# EAGLE design working (EAGLE 5.12)
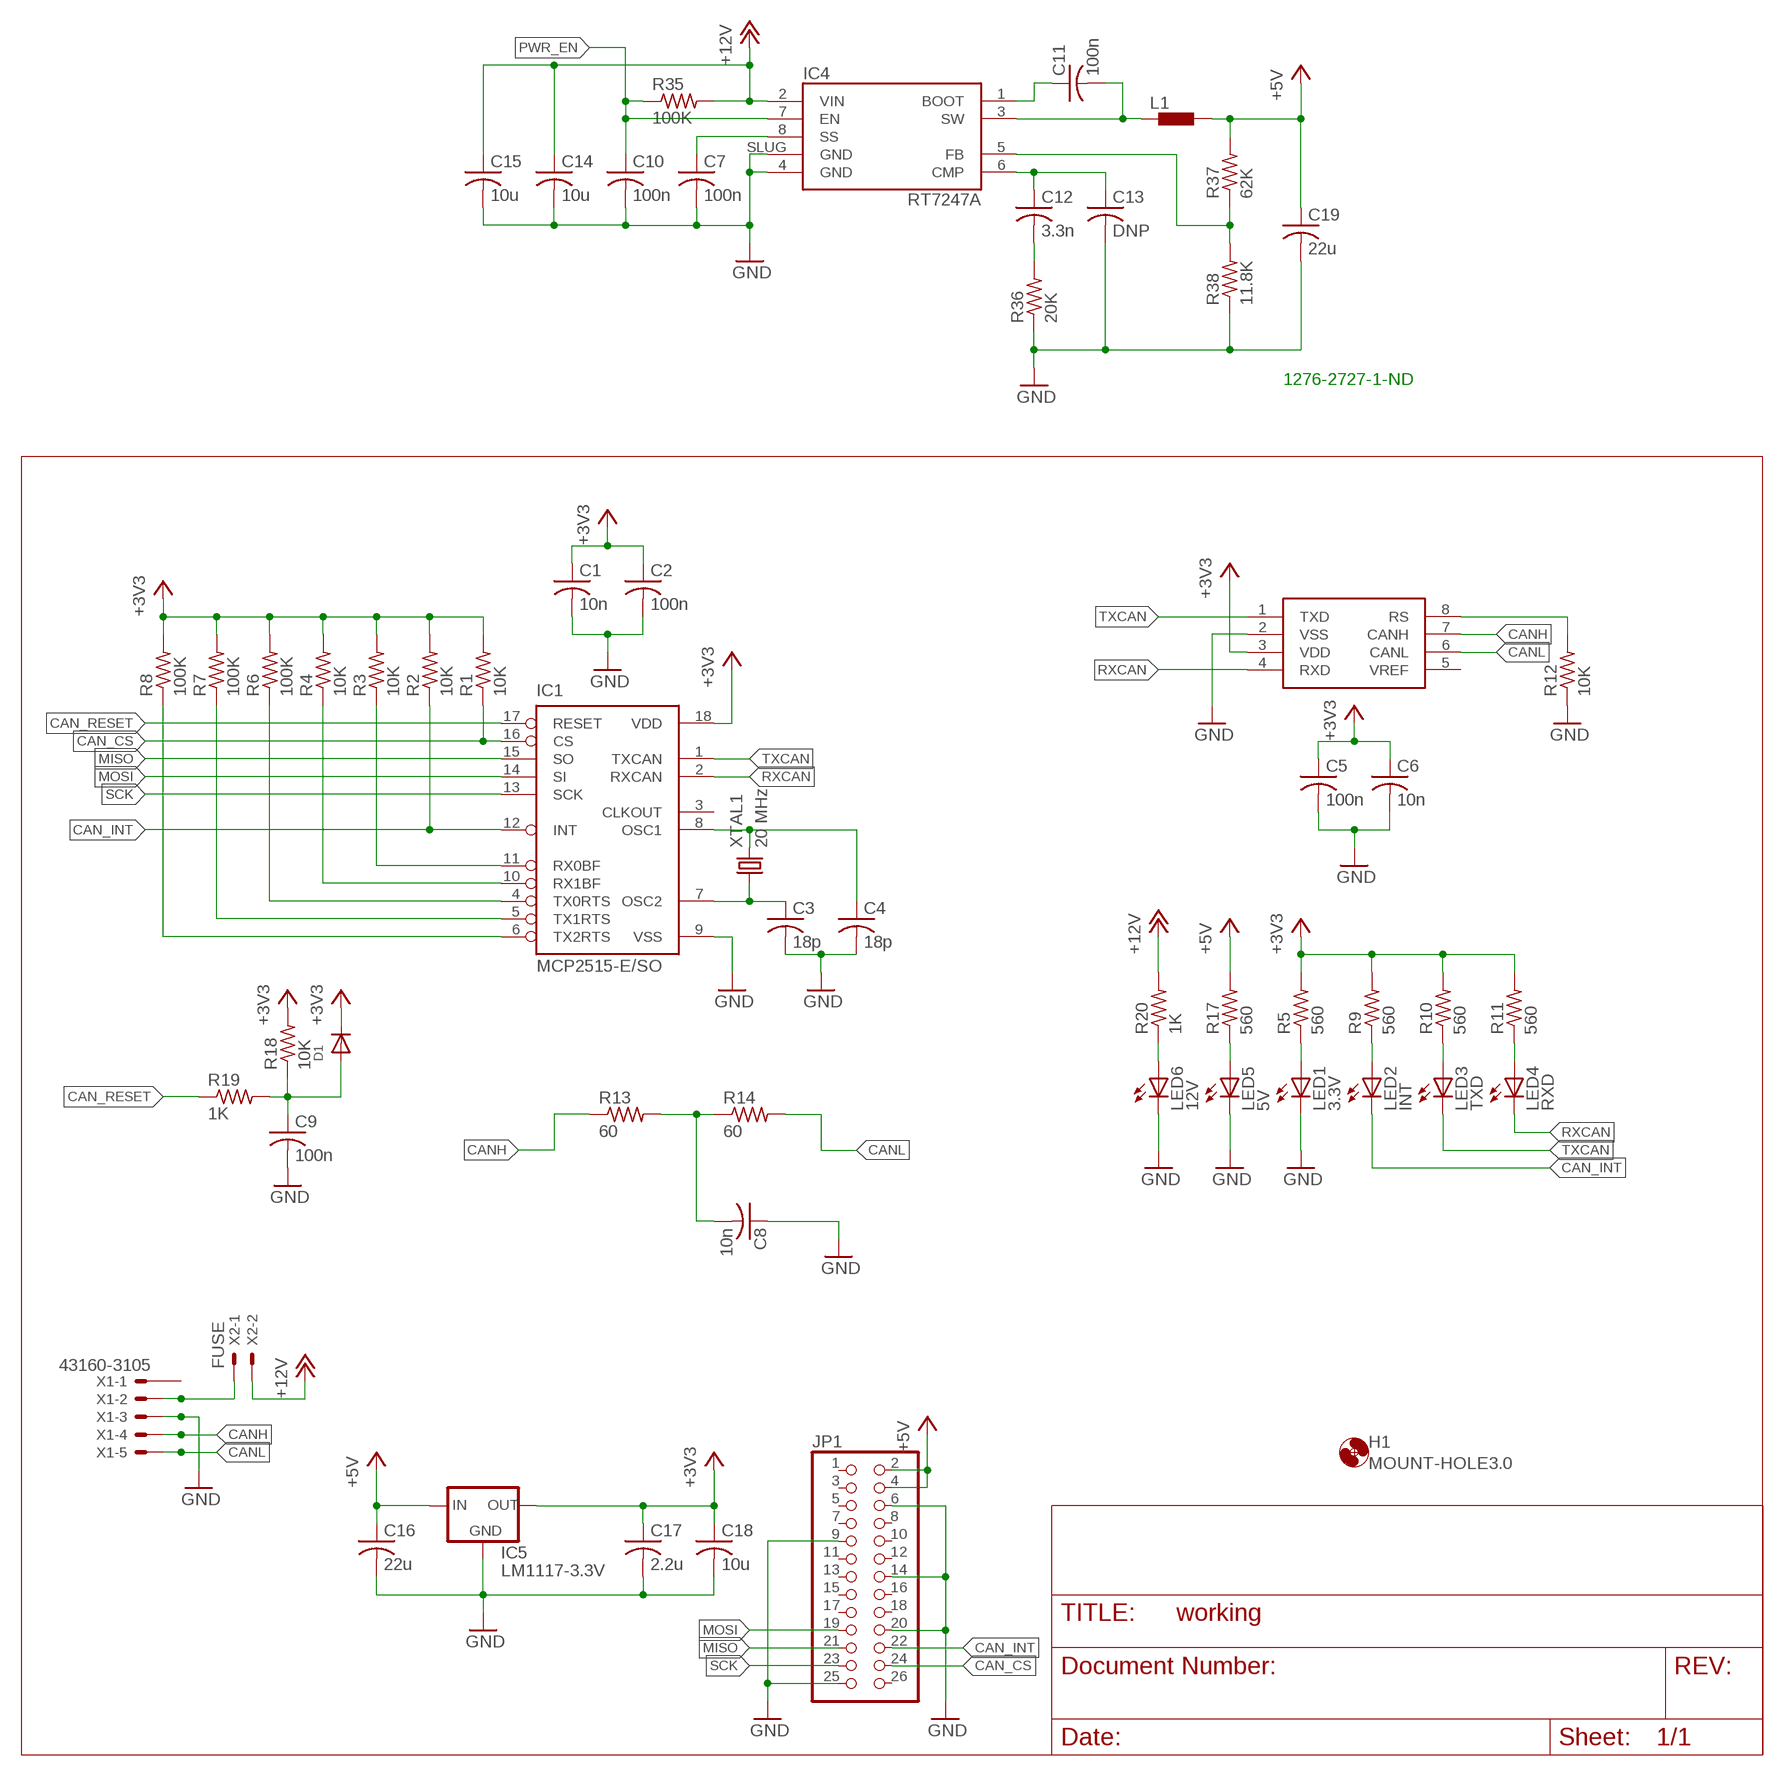
[diagram p0: schematic, sheet 1]

## Parts
C1  10n  C-USC0603  [C0603]
C2  100n  C-USC0603  [C0603]
C3  18p  C-USC0603  [C0603]
C4  18p  C-USC0603  [C0603]
C5  100n  C-USC0603  [C0603]
C6  10n  C-USC0603  [C0603]
C7  100n  C-USC0603  [C0603]
C8  10n  C-USC0603  [C0603]
C9  100n  C-USC0603  [C0603]
C10  100n  C-USC0603  [C0603]
C11  100n  C-USC0603  [C0603]
C12  3.3n  C-USC0603  [C0603]
C13  DNP  C-USC0603  [C0603]
C14  10u  C-USC1206  [C1206]
C15  10u  C-USC1206  [C1206]
C16  22u  C-USC1206  [C1206]
C17  2.2u  C-USC0805  [C0805]
C18  10u  C-USC1206  [C1206]
C19  22u  C-USC1206  [C1206]
D1  DIODESMA  [SMADIODE]
H1  MOUNT-HOLE3.0  [3,0]
IC1  MCP2515-E/SO  [SO18L]
IC2  SN65HVD232D  MCP2551  [SO08]
IC4  RT7247A  [SO08]
IC5  LM1117-3.3V  LM1117  [SOT223]
JP1  PINHD-2X13  [2X13]
L1  DR1030  [DR1030]
LED1  3.3V  LEDCHIP-LED0805  [CHIP-LED0805]
LED2  INT  LEDCHIP-LED0805  [CHIP-LED0805]
LED3  TXD  LEDCHIP-LED0805  [CHIP-LED0805]
LED4  RXD  LEDCHIP-LED0805  [CHIP-LED0805]
LED5  5V  LEDCHIP-LED0805  [CHIP-LED0805]
LED6  12V  LEDCHIP-LED0805  [CHIP-LED0805]
R1  10K  R-US_R0603  [R0603]
R2  10K  R-US_R0603  [R0603]
R3  10K  R-US_R0603  [R0603]
R4  10K  R-US_R0603  [R0603]
R5  560  R-US_R0603  [R0603]
R6  100K  R-US_R0603  [R0603]
R7  100K  R-US_R0603  [R0603]
R8  100K  R-US_R0603  [R0603]
R9  560  R-US_R0603  [R0603]
R10  560  R-US_R0603  [R0603]
R11  560  R-US_R0603  [R0603]
R12  10K  R-US_R0603  [R0603]
R13  60  R-US_R0603  [R0603]
R14  60  R-US_R0603  [R0603]
R17  560  R-US_R0603  [R0603]
R18  10K  R-US_R0603  [R0603]
R19  1K  R-US_R0603  [R0603]
R20  1K  R-US_R0603  [R0603]
R35  100K  R-US_R0603  [R0603]
R36  20K  R-US_R0603  [R0603]
R37  62K  R-US_R0603  [R0603]
R38  11.8K  R-US_R0603  [R0603]
X1  43160-3105  [43160-XX05]
X2  FUSE  22-23-2021  [22-23-2021]
XTAL1  20 MHz  CRYSTALSM49  [SM49]

## Nets
+3V3: C1.1 C2.1 C5.1 C6.1 C17.1 C18.1 D1.C IC1.18(VDD) IC2.3(VDD) IC5.2(OUT) R1.2 R2.2 R3.2 R4.2 R5.2 R6.2 R7.2 R8.2 R9.2 R10.2 R11.2 R18.2
+5V: C16.1 C19.1 IC5.3(IN) JP1.2 JP1.4 L1.2 R17.2 R37.2
+12V: C14.1 C15.1 IC4.2(VIN) R20.2 R35.2 X2.2
CAN_CS: IC1.16(CS) JP1.24 R1.1
CAN_INT: IC1.12(INT) JP1.22 LED2.C R2.1
CAN_RESET: IC1.17(RESET) R19.1
CANH: IC2.7(CANH) R13.1 X1.4@1(-4:S) X1.4@2(-4:S)
CANL: IC2.6(CANL) R14.2 X1.5@1(-5:S) X1.5@2(-5:S)
GND: C1.2 C2.2 C3.2 C4.2 C5.2 C6.2 C7.2 C8.1 C9.2 C10.2 C13.2 C14.2 C15.2 C16.2 C17.2 C18.2 C19.2 IC1.9(VSS) IC2.2(VSS) IC4.4(GND) IC4.SLUG(GND) IC5.1(GND) JP1.6 JP1.9 JP1.14 JP1.20 JP1.25 LED1.C LED5.C LED6.C R12.1 R36.1 R38.1 X1.3@1(-3:S) X1.3@2(-3:S)
MISO: IC1.15(SO) JP1.21
MOSI: IC1.14(SI) JP1.19
N$1: IC1.11(RX0BF) R3.1
N$2: IC1.10(RX1BF) R4.1
N$3: IC1.4(TX0RTS) R6.1
N$4: IC1.5(TX1RTS) R7.1
N$5: IC1.6(TX2RTS) R8.1
N$6: C4.1 IC1.8(OSC1) XTAL1.2
N$7: C3.1 IC1.7(OSC2) XTAL1.1
N$8: IC2.8(RS) R12.2
N$9: LED1.A R5.1
N$10: LED2.A R9.1
N$11: LED3.A R10.1
N$12: LED4.A R11.1
N$18: C8.2 R13.2 R14.1
N$19: LED5.A R17.1
N$20: C9.1 D1.A R18.1 R19.2
N$21: LED6.A R20.1
N$69: X1.2@1(-2:S) X1.2@2(-2:S) X2.1
N$92: C7.1 IC4.8(SS)
N$95: C11.1 IC4.1(BOOT)
N$96: C11.2 IC4.3(SW) L1.1
N$97: C12.1 C13.1 IC4.6(CMP)
N$98: C12.2 R36.2
N$99: IC4.5(FB) R37.1 R38.2
PWR_EN: C10.1 IC4.7(EN) R35.1
RXCAN: IC1.2(RXCAN) IC2.4(RXD) LED4.C
SCK: IC1.13(SCK) JP1.23
TXCAN: IC1.1(TXCAN) IC2.1(TXD) LED3.C
Unconnected: IC1.3(CLKOUT) IC2.5(VREF) JP1.1 JP1.3 JP1.5 JP1.7 JP1.8 JP1.10 JP1.11 JP1.12 JP1.13 JP1.15 JP1.16 JP1.17 JP1.18 JP1.26 X1.1@1(-1:S) X1.1@2(-1:S)

## Notes on the sheet
- 1276-2727-1-ND

## Library data of the parts
C1-C19 = rcl:C-US: CAPACITOR, American symbol
D1 = adafruit:DIODE: Diode SMADIODE - SMA Surface Mount Package 20V 1A Schottky Diode Digikey: 641-1014-6-ND DO-1N4148 - Through Hole Small Current Diode SOD-123 20V 1 A (.5mV Vf) Schottky Diode - Digikey: MBRX120TPMSCT-ND SOD-323 10V 570mA (.38mV Vf, 3ns) Schottky Diode - Digikey: ZLLS410CT-ND SOD-523 30V 30mA Schottky Diode (RB751S-40TE61) - Digikey: RB751S-40TE61CT-ND SOT23-R/W - SOT23 Package (R = Solder Paste/Reflow Ovens, W = Hand-Soldering) BAT54Film 40V 300mA - Digikey: 497-7162-1-ND
H1 = holes:MOUNT-HOLE: MOUNTING HOLE with drill center marker
IC1 = mcp2515:MCP2515
IC2 = SparkFun:MCP2551
IC4 = rbg-richtek-vreg:RT7247A
IC5 = v-reg-3:LM1117
JP1 = pinhead:PINHD-2X13: PIN HEADER
L1 = inductors:DR1030: DR1030 Series Low Profile Power Inductors Source: Data sheet <http://www.cooperbussmann.com/pdf/c73e479f-f867-4c64-ae26-9c1f23814163.pdf>
LED1-LED6 = led:LED: LED OSRAM: - CHIPLED LG R971, LG N971, LY N971, LG Q971, LY Q971, LO R971, LY R971 LH N974, LH R974 LS Q976, LO Q976, LY Q976 LO Q996 - Hyper CHIPLED LW Q18S LB Q993, LB Q99A, LB R99A - SideLED LS A670, LO A670, LY A670, LG A670, LP A670 LB A673, LV A673, LT A673, LW A673 LH A674 LY A675 LS A676, LA A676, LO A676, LY A676, LW A676 LS A679, LY A679, LG A679 - Hyper Micro SIDELED® LS Y876, LA Y876, LO Y876, LY Y876 LT Y87S - SmartLED LW L88C, LW L88S LB L89C, LB L89S, LG L890 LS L89K, LO L89K, LY L89K LS L896, LA L896, LO L896, LY L896 - TOPLED LS T670, LO T670, LY T670, LG T670, LP T670 LSG T670, LSP T670, LSY T670, LOP T670, LYG T670 LG T671, LOG T671, LSG T671 LB T673, LV T673, LT T673, LW T673 LH T674 LS T676, LA T676, LO T676, LY T676, LB T676, LH T676, LSB T676, LW T676 LB T67C, LV T67C, LT T67C, LS T67K, LO T67K, LY T67K, LW E67C LS E67B, LA E67B, LO E67B, LY E67B, LB E67C, LV E67C, LT E67C LW T67C LS T679, LY T679, LG T679 LS T770, LO T770, LY T770, LG T770, LP T770 LB T773, LV T773, LT T773, LW T773 LH T774 LS E675, LA E675, LY E675, LS T675 LS T776, LA T776, LO T776, LY T776, LB T776 LHGB T686 LT T68C, LB T68C - Hyper Mini TOPLED® LB M676 - Mini TOPLED Santana® LG M470 LS M47K, LO M47K, LY M47K Source: http://www.osram.convergy.de LUXEON: - LUMILED® LXK2-PW12-R00, LXK2-PW12-S00, LXK2-PW14-U00, LXK2-PW14-V00 LXK2-PM12-R00, LXK2-PM12-S00, LXK2-PM14-U00 LXK2-PE12-Q00, LXK2-PE12-R00, LXK2-PE12-S00, LXK2-PE14-T00, LXK2-PE14-U00 LXK2-PB12-K00, LXK2-PB12-L00, LXK2-PB12-M00, LXK2-PB14-N00, LXK2-PB14-P00, LXK2-PB14-Q00 LXK2-PR12-L00, LXK2-PR12-M00, LXK2-PR14-Q00, LXK2-PR14-R00 LXK2-PD12-Q00, LXK2-PD12-R00, LXK2-PD12-S00 LXK2-PH12-R00, LXK2-PH12-S00 LXK2-PL12-P00, LXK2-PL12-Q00, LXK2-PL12-R00 Source: www.luxeon.com KINGBRIGHT: KA-3528ASYC Source: www.kingbright.com
R1-R14 R17-R20 R35-R38 = rcl:R-US_: RESISTOR, American symbol
X1 = con-molex:43160-*05: SDA-43160 Connector Source: http://www.molex.com/pdm_docs/sd/431601306_sd.pdf; MF: WALDOM/MOLEX; MPN: 43160-3105; OC_FARNELL: unknown; OC_NEWARK: 54H0267
X2 = con-molex:22-23-2021: .100" (2.54mm) Center Header - 2 Pin; MF: MOLEX; MPN: 22-23-2021; OC_FARNELL: 1462926; OC_NEWARK: 25C3832
XTAL1 = crystal:CRYSTAL: CRYSTAL; OC_FARNELL: unknown; OC_NEWARK: unknown

## Board
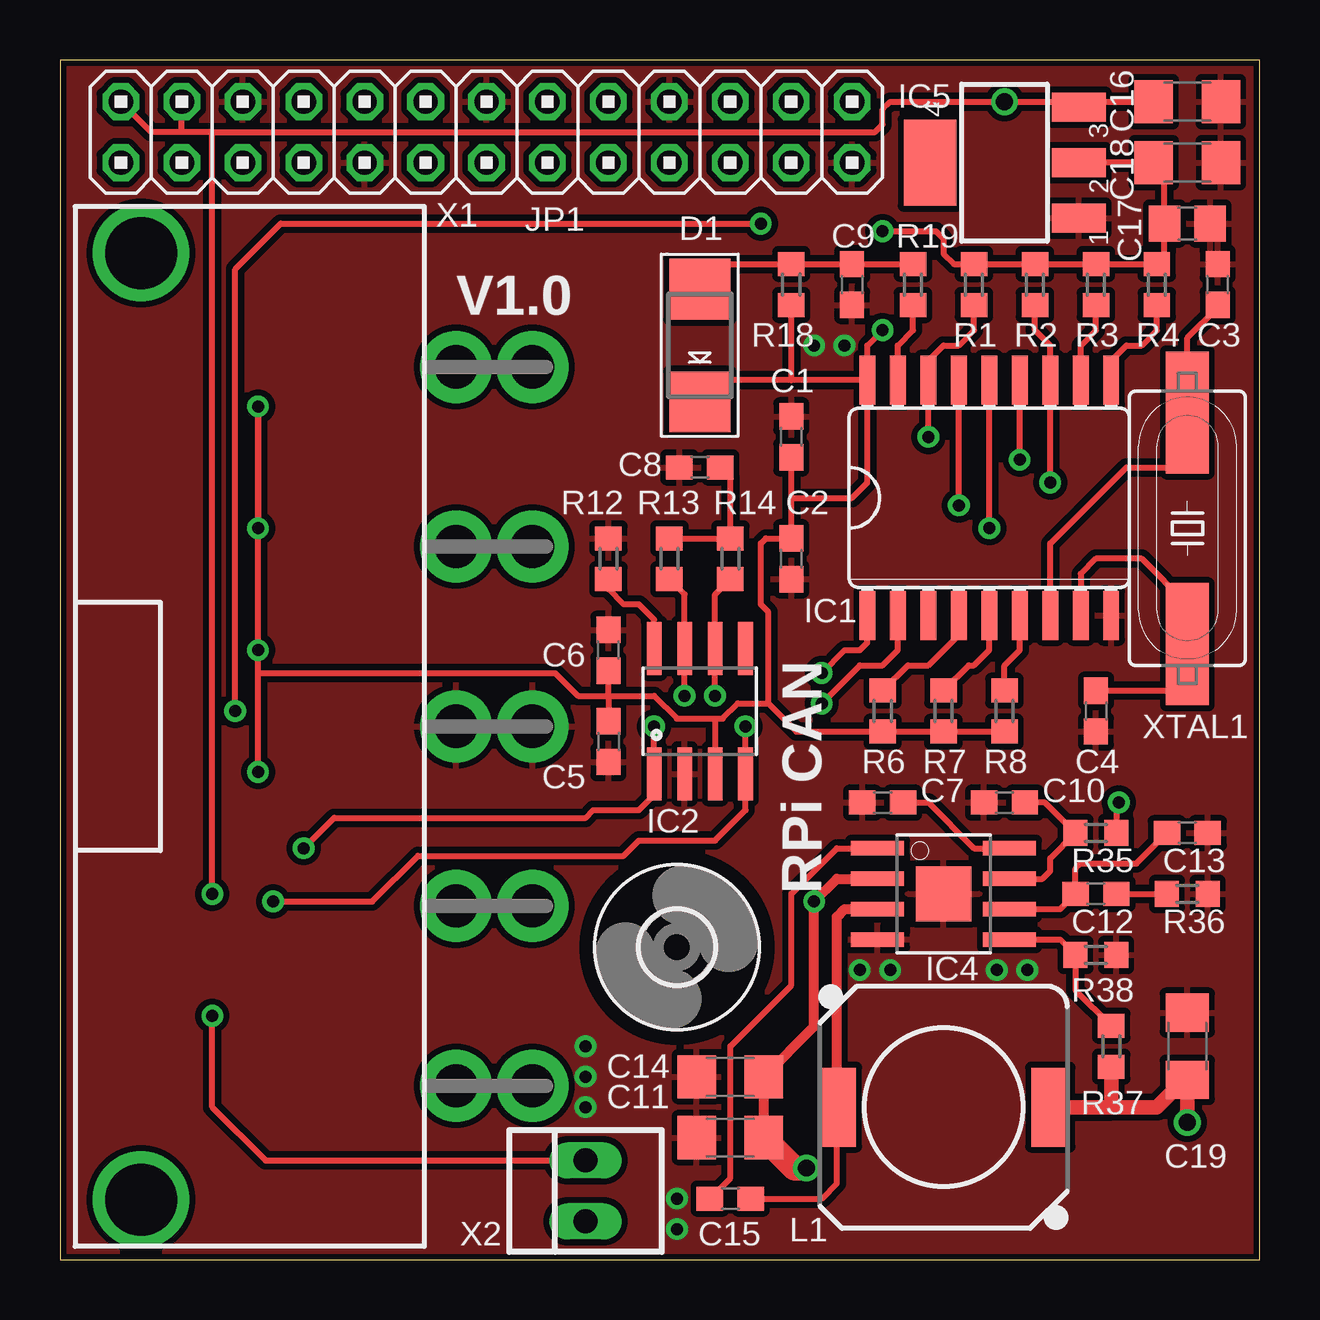
[diagram p1: board, top side]
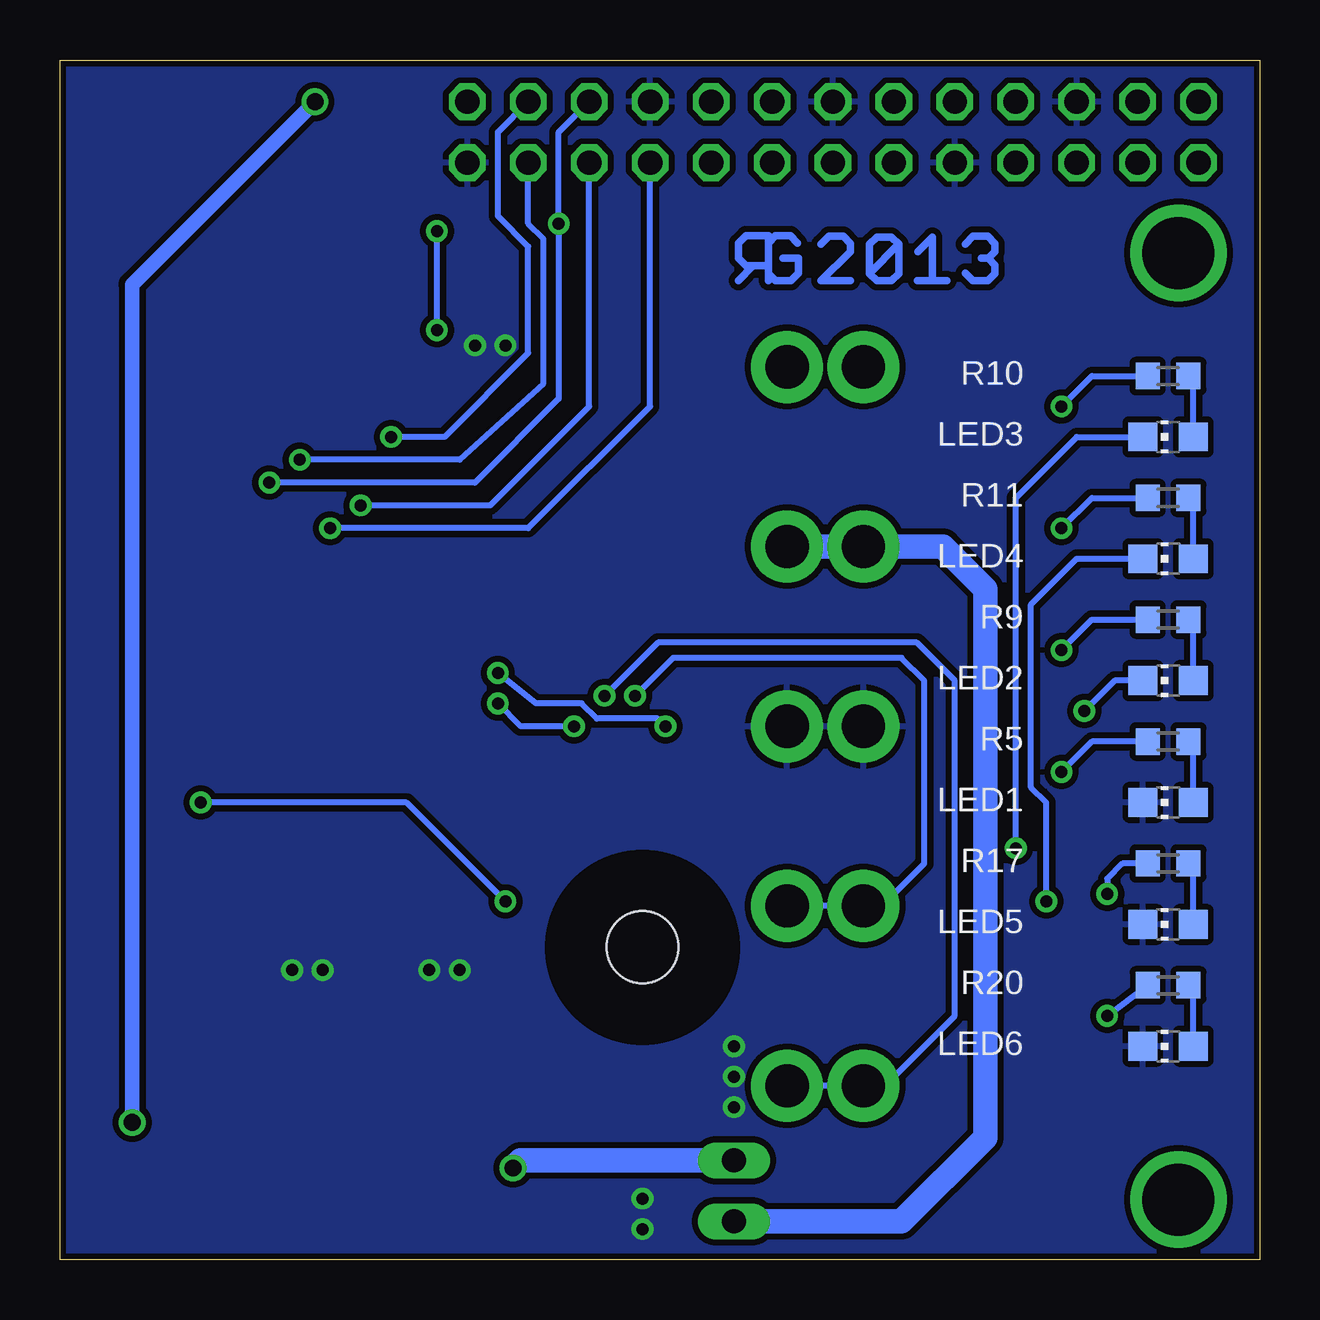
[diagram p2: board, bottom side, seen from below]

Size 50 x 50 mm. Coordinates in mm from the lower left corner, seen from the top.
Outline: 0,0 50,0 50,50 0,50 0,0
Copper layers (1*16): Top 0.035mm / dielectric 1.5mm / Bottom 0.035mm
Design rules "default *": minimum track width 10mil, minimum drill 19mil, track to track 10mil, track to pad 10mil, pad to pad 10mil, via to via 10mil, smd to smd 10mil, copper to edge 10mil, drill to drill 8mil, minimum pad ring 10mil, minimum via ring 8mil, stop-mask expansion 4mil, vias tented up to drill 20mil, thermal gap 10mil

### Footprints (pad centres in the part's own frame; a part is rotated, then mirrored left to right if it is on the bottom)
C0603 = smd 1.1 x 1: 1 -0.85,0; 2 0.85,0
C1206 = smd 1.6 x 1.8: 1 -1.4,0; 2 1.4,0
C0805 = smd 1.3 x 1.5: 1 -0.95,0; 2 0.95,0
SMADIODE = smd 2.54 x 2.54: A 2.349,0; C -2.349,0
3,0 = hole 3: 0,0
SO18L = smd 0.66 x 2.032: 1 -5.08,-4.902; 2 -3.81,-4.902; 3 -2.54,-4.902; 4 -1.27,-4.902; 5 0,-4.902; 6 1.27,-4.902; 7 2.54,-4.902; 8 3.81,-4.902; 9 5.08,-4.902; 10 5.08,4.902; 11 3.81,4.902; 12 2.54,4.902; 13 1.27,4.902; 14 0,4.902; 15 -1.27,4.902; 16 -2.54,4.902; 17 -3.81,4.902; 18 -5.08,4.902
SO08 = smd 0.61 x 2.21: 1 -1.905,-2.616; 2 -0.635,-2.616; 3 0.635,-2.616; 4 1.905,-2.616; 5 1.905,2.616; 6 0.635,2.616; 7 -0.635,2.616; 8 -1.905,2.616
SO08' = smd 0.61 x 2.21: 1 -1.905,-2.75; 2 -0.635,-2.75; 3 0.635,-2.75; 4 1.905,-2.75; 5 1.905,2.75; 6 0.635,2.75; 7 -0.635,2.75; 8 -1.905,2.75 | smd 2.3 x 2.3: SLUG 0,0
SOT223 = smd 1.219 x 2.235: 1 -2.311,-3.099; 2 0,-3.099; 3 2.311,-3.099 | smd 3.6 x 2.2: 4 0,3.099
2X13 = drill 1.016 octagon: 1 -15.24,-1.27; 2 -15.24,1.27; 3 -12.7,-1.27; 4 -12.7,1.27; 5 -10.16,-1.27; 6 -10.16,1.27; 7 -7.62,-1.27; 8 -7.62,1.27; 9 -5.08,-1.27; 10 -5.08,1.27; 11 -2.54,-1.27; 12 -2.54,1.27; 13 0,-1.27; 14 0,1.27; 15 2.54,-1.27; 16 2.54,1.27; 17 5.08,-1.27; 18 5.08,1.27; 19 7.62,-1.27; 20 7.62,1.27; 21 10.16,-1.27; 22 10.16,1.27; 23 12.7,-1.27; 24 12.7,1.27; 25 15.24,-1.27; 26 15.24,1.27
DR1030 = smd 3.3 x 1.6: 1 0,4.45; 2 0,-4.45
CHIP-LED0805 = smd 1.2 x 1.2: A 0,-1.05; C 0,1.05
R0603 = smd 1 x 1.1: 1 -0.85,0; 2 0.85,0
43160-XX05 = drill 1.8 pad 3 round: 1@1 -14.98,0; 1@2 -14.98,3.18; 2@1 -7.49,0; 2@2 -7.49,3.18; 3@1 0,0; 3@2 0,3.18; 4@1 7.49,0; 4@2 7.49,3.18; 5@1 14.98,0; 5@2 14.98,3.18 | drill 3 pad 3.4 round: M1 -19.73,-13.13; M2 19.73,-13.13
22-23-2021 = drill 1 long: 1 -1.27,0; 2 1.27,0
SM49 = smd 5.08 x 1.778: 1 -4.826,0; 2 4.826,0

### Placement (x,y rotation side)
C1  30.48,34.29 90 top
C2  30.48,29.21 270 top
C3  48.26,40.64 90 top
C4  43.18,22.86 270 top
C5  22.86,21.59 270 top
C6  22.86,25.4 90 top
C7  34.29,19.05 180 top
C8  26.67,33.02 0 top
C9  33.02,40.64 270 top
C10  39.37,19.05 180 top
C11  27.94,2.54 0 top
C12  43.18,15.24 0 top
C13  46.99,17.78 0 top
C14  27.94,7.62 180 top
C15  27.94,5.08 180 top
C16  46.99,48.26 0 top
C17  46.99,43.18 0 top
C18  46.99,45.72 0 top
C19  46.99,8.89 90 top
D1  26.67,38.1 90 top
H1  25.72,13.02 0 top
IC1  38.73,31.75 0 top
IC2  26.67,22.86 0 top
IC4  RT7247A  [SO08']  36.83,15.24 270 top
IC5  39.37,45.72 90 top
JP1  17.78,46.99 0 top
L1  36.83,6.35 90 top
LED1  3.81,19.05 90 bottom
LED2  3.81,24.13 90 bottom
LED3  3.81,34.29 90 bottom
LED4  3.81,29.21 90 bottom
LED5  3.81,13.97 90 bottom
LED6  3.81,8.89 90 bottom
R1  38.1,40.64 90 top
R2  40.64,40.64 90 top
R3  43.18,40.64 90 top
R4  45.72,40.64 90 top
R5  3.81,21.59 180 bottom
R6  34.29,22.86 270 top
R7  36.83,22.86 270 top
R8  39.37,22.86 270 top
R9  3.81,26.67 180 bottom
R10  3.81,36.83 180 bottom
R11  3.81,31.75 180 bottom
R12  22.86,29.21 270 top
R13  25.4,29.21 90 top
R14  27.94,29.21 270 top
R17  3.81,16.51 180 bottom
R18  30.48,40.64 270 top
R19  35.56,40.64 90 top
R20  3.81,11.43 180 bottom
R35  43.18,17.78 0 top
R36  46.99,15.24 180 top
R37  43.81,8.89 270 top
R38  43.18,12.7 180 top
U$1  [RGLOGO_SMALL_2013]  20.32,40.64 0 bottom
X1  16.51,22.23 270 top
X2  21.91,2.86 90 top
XTAL1  46.99,30.48 270 top

### Tracks (layer width: path | path; a pad name or v marks a point on that pad's centre or on a via)
+3V3  (via drill 0.5)
  Top 0.254: 30.48,31.75 C2.1 29.43,30.06 29.21,29.84 29.21,27.3 29.53,26.99 29.53,23.18 | 30.48,31.75 C1.1 | IC1.18 33.66,32.38 33.02,31.75 30.48,31.75 | C5.1 22.86,22.23 23.07,22.23 C5.1 | 22.86,23.5 C6.1 | IC1.18 30.48,36.65 | 30.48,36.65 R18.2 | 30.48,36.65 26.67,36.65 D1.C | R8.2 R7.2 R6.2 30.7,22.01 29.53,23.18 | IC5.2 C18.1 46.04,45.27 C17.1 46.04,41.81 R4.2 R3.2 R2.2 R1.2 37.25,41.49 36.83,41.91 36.83,42.55 36.51,42.86 v34.29,42.86 | v8.26,20.32 8.26,24.45 | 8.26,24.45 v8.26,25.4 v8.26,35.56 v8.26,30.48 | 27.3,22.54 IC2.3 | 27.3,22.54 25.72,22.54 24.77,23.5 22.86,23.5 | 29.53,23.18 28.26,23.18 27.62,22.54 27.3,22.54 | 22.86,23.5 C5.1 | 22.86,23.5 21.59,23.5 20.64,24.45 8.26,24.45 | v34.29,38.73 33.66,38.1 IC1.18
  Bottom 0.254: R5.2 6.99,21.59 v8.26,20.32 | v8.26,30.48 6.99,31.75 R11.2 | v8.26,35.56 6.99,36.83 R10.2 | v8.26,25.4 6.99,26.67 R9.2 | v34.29,38.73 v34.29,42.86
+5V  (via drill 0.5, 0.7)
  Top 0.254: 6.35,46.99 33.97,46.99 34.29,47.31 34.29,47.94 34.61,48.26 v39.37,48.26 41.91,48.26 42.14,48.03 IC5.3 42.7,48.26 C16.1 | 6.35,46.99 5.08,46.99 | 5.08,46.99 3.81,46.99 JP1.2 | v6.35,15.24 6.35,46.99 | 5.08,46.99 JP1.4
  Top 0.61: v46.99,5.71 46.99,6.99 | 46.99,6.99 C19.1 | R37.2 43.81,6.35 L1.2 45.72,6.35 46.35,6.99 46.99,6.99
  Bottom 0.254: R17.2 5.71,16.51 6.35,15.88 v6.35,15.24
  Bottom 0.61: v46.99,5.71 46.99,40.64 v39.37,48.26
+12V  (via drill 0.5, 0.7)
  Top 0.254: R35.2 44.03,18.95 v44.13,19.05 | X2.2 8.57,4.13 6.35,6.35 v6.35,10.16
  Top 0.406: IC4.2 32.38,15.88 v31.43,14.92 31.43,9.71 C14.1 C15.1
  Top 1.016: v31.11,3.81 30.61,3.81 C15.1
  Bottom 0.254: v6.35,10.16 R20.2 | v44.13,19.05 35.56,19.05 v31.43,14.92
  Bottom 1.016: X2.2 30.8,4.13 v31.11,3.81
CAN_CS  (via drill 0.5)
  Top 0.254: R1.1 38.1,38.73 37.47,38.1 36.83,38.1 36.2,37.47 IC1.16 v36.2,34.29
  Bottom 0.254: v36.2,34.29 33.97,34.29 30.48,37.78 30.48,42.23 31.75,43.5 31.75,46.99 JP1.24
CAN_INT  (via drill 0.5)
  Top 0.254: R2.1 40.64,38.73 41.27,38.1 IC1.12 v41.27,32.38 | v7.3,22.86 7.3,41.27 9.21,43.18 v29.21,43.18
  Bottom 0.254: v41.27,32.38 32.7,32.38 29.21,35.88 v29.21,43.18 29.21,46.99 JP1.22 | LED2.C 6.03,24.13 v7.3,22.86
CAN_RESET
  Top 0.254: R19.1 35.56,38.73 34.92,38.1 IC1.17
CANH  (via drill 0.5)
  Top 0.254: R13.1 26.04,27.73 IC2.7 v26.04,23.5
  Bottom 0.254: v26.04,23.5 24.45,25.08 14.92,25.08 13.97,24.13 13.97,16.51 15.74,14.73 X1.4@1 X1.4@2
CANL  (via drill 0.5)
  Top 0.254: R14.2 27.3,27.73 IC2.6 v27.3,23.5
  Bottom 0.254: v27.3,23.5 25.08,25.72 14.29,25.72 12.7,24.13 12.7,10.16 15.62,7.25 X1.5@1 X1.5@2
GND  (via drill 0.5)
  other vias: 32.7,38.1 31.43,38.1 25.72,2.54 25.72,1.27 21.91,6.35 21.91,7.62 21.91,8.89 33.34,12.06 39.05,12.06 40.32,12.06 34.61,12.06
  pour Bottom: -1.27,50.8 50.8,50.8 50.8,-1.27 -1.27,-1.27
  pour Top: -1.27,50.8 50.8,50.8 50.8,-1.27 -1.27,-1.27
MISO  (via drill 0.5)
  Top 0.254: v37.47,31.43 IC1.15
  Bottom 0.254: v37.47,31.43 32.07,31.43 27.94,35.56 JP1.21
MOSI  (via drill 0.5)
  Top 0.254: v38.73,30.48 IC1.14
  Bottom 0.254: v38.73,30.48 30.48,30.48 25.4,35.56 JP1.19
N$1
  Top 0.254: R3.1 43.18,38.73 42.55,38.1 IC1.11
N$2
  Top 0.254: R4.1 45.72,38.73 45.09,38.1 44.45,38.1 43.81,37.47 IC1.10
N$3
  Top 0.254: IC1.4 37.47,26.04 36.2,24.77 35.34,24.77 R6.1
N$4
  Top 0.254: IC1.5 38.73,25.4 38.1,24.77 37.88,24.77 R7.1
N$5
  Top 0.254: IC1.6 40.01,25.4 39.37,24.77 R8.1
N$6
  Top 0.254: IC1.8 42.55,28.57 43.18,29.21 45.09,29.21 46.99,27.3 XTAL1.2 46.99,24.45 46.25,23.71 C4.1
N$7
  Top 0.254: IC1.7 41.27,29.84 44.45,33.02 46.99,33.02 XTAL1.1 46.99,38.42 48.26,39.69 C3.1
N$8
  Top 0.254: IC2.8 24.77,26.67 24.13,27.3 23.5,27.3 22.86,27.94 R12.2
N$9
  Bottom 0.254: LED1.A 2.76,21.39 R5.1
N$10
  Bottom 0.254: LED2.A 2.76,26.47 R9.1
N$11
  Bottom 0.254: LED3.A 2.76,36.63 R10.1
N$12
  Bottom 0.254: LED4.A 2.76,31.55 R11.1
N$18
  Top 0.254: R13.2 R14.1 27.94,32.6 C8.2
N$19
  Bottom 0.254: LED5.A 2.76,16.31 R17.1
N$20
  Top 0.254: R19.2 C9.1 R18.1 27.71,41.49 D1.A
N$21
  Bottom 0.254: LED6.A 2.76,11.23 R20.1
N$69
  Bottom 1.016: X1.2@2 X1.2@1 13.21,29.71 11.43,27.94 11.43,5.08 14.92,1.59 X2.1
N$92
  Top 0.254: IC4.8 38.1,17.14 36.2,19.05 C7.1
N$95
  Top 0.254: IC4.1 32.38,17.14 30.48,15.24 30.48,11.43 27.94,8.89 27.94,3.39 C11.1
N$96
  Top 0.254: C11.2 31.75,2.54 32.38,3.17 L1.1
  Top 0.406: IC4.3 32.7,14.61 32.38,14.29 L1.1
N$97
  Top 0.254: IC4.6 41.7,14.61 C12.1 42.33,16.3 42.55,16.51 44.87,16.51 C13.1
N$98
  Top 0.254: C12.2 R36.2
N$99
  Top 0.254: IC4.5 41.7,13.34 R38.2 42.33,11.22 R37.1
PWR_EN
  Top 0.254: IC4.7 40.96,15.88 41.27,16.19 41.27,16.73 R35.1 41.06,19.05 C10.1
RXCAN  (via drill 0.5)
  Top 0.254: IC1.2 34.92,25.4 34.29,24.77 33.34,24.77 v31.75,23.18 | v28.57,22.23 IC2.4 28.57,18.73 27.3,17.46 24.13,17.46 23.5,16.83 14.92,16.83 13.02,14.92 v8.89,14.92
  Bottom 0.254: v31.75,23.18 30.8,22.23 v28.57,22.23 | LED4.C 7.62,29.21 9.53,27.3 9.53,19.68 8.89,19.05 v8.89,14.92
SCK  (via drill 0.5)
  Top 0.254: v40.01,33.34 IC1.13
  Bottom 0.254: v40.01,33.34 33.34,33.34 29.84,36.51 29.84,42.55 30.48,43.18 JP1.23
TXCAN  (via drill 0.5)
  Top 0.254: v24.77,22.23 IC2.1 24.77,19.37 24.13,18.73 22.23,18.73 21.91,18.41 11.43,18.41 v10.16,17.14 | IC1.1 33.66,25.72 33.34,25.4 32.7,25.4 v31.75,24.45
  Bottom 0.254: v24.77,22.23 25.08,22.54 27.62,22.54 28.26,23.18 30.16,23.18 v31.75,24.45 | LED3.C 7.62,34.29 10.16,31.75 v10.16,17.14

### Text on the board
tNames: V1.0 | RPi CAN